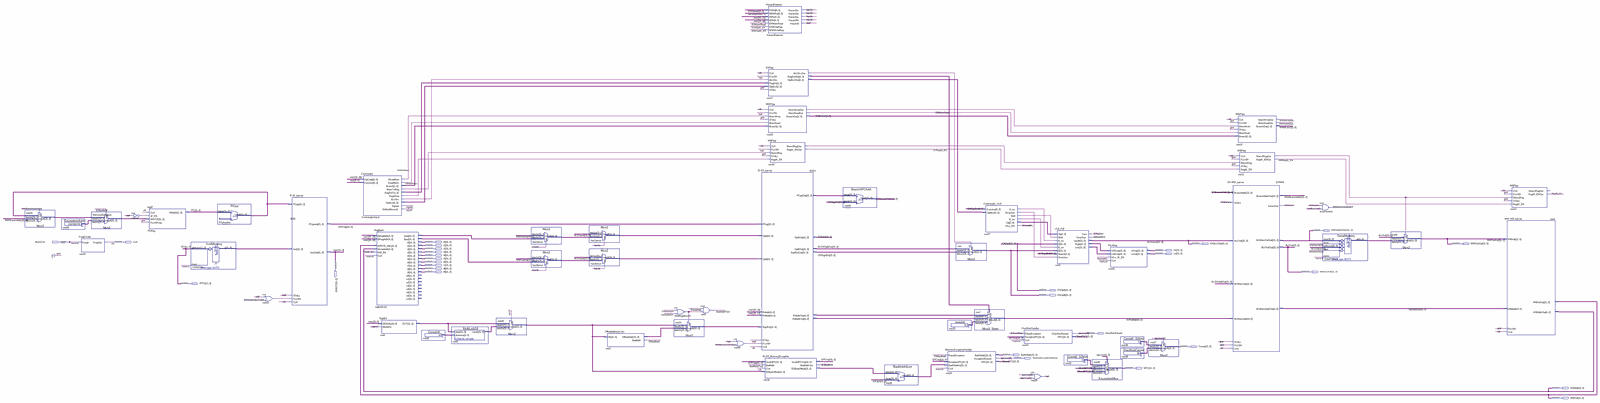
[diagram p0: schematic sheet, whole]
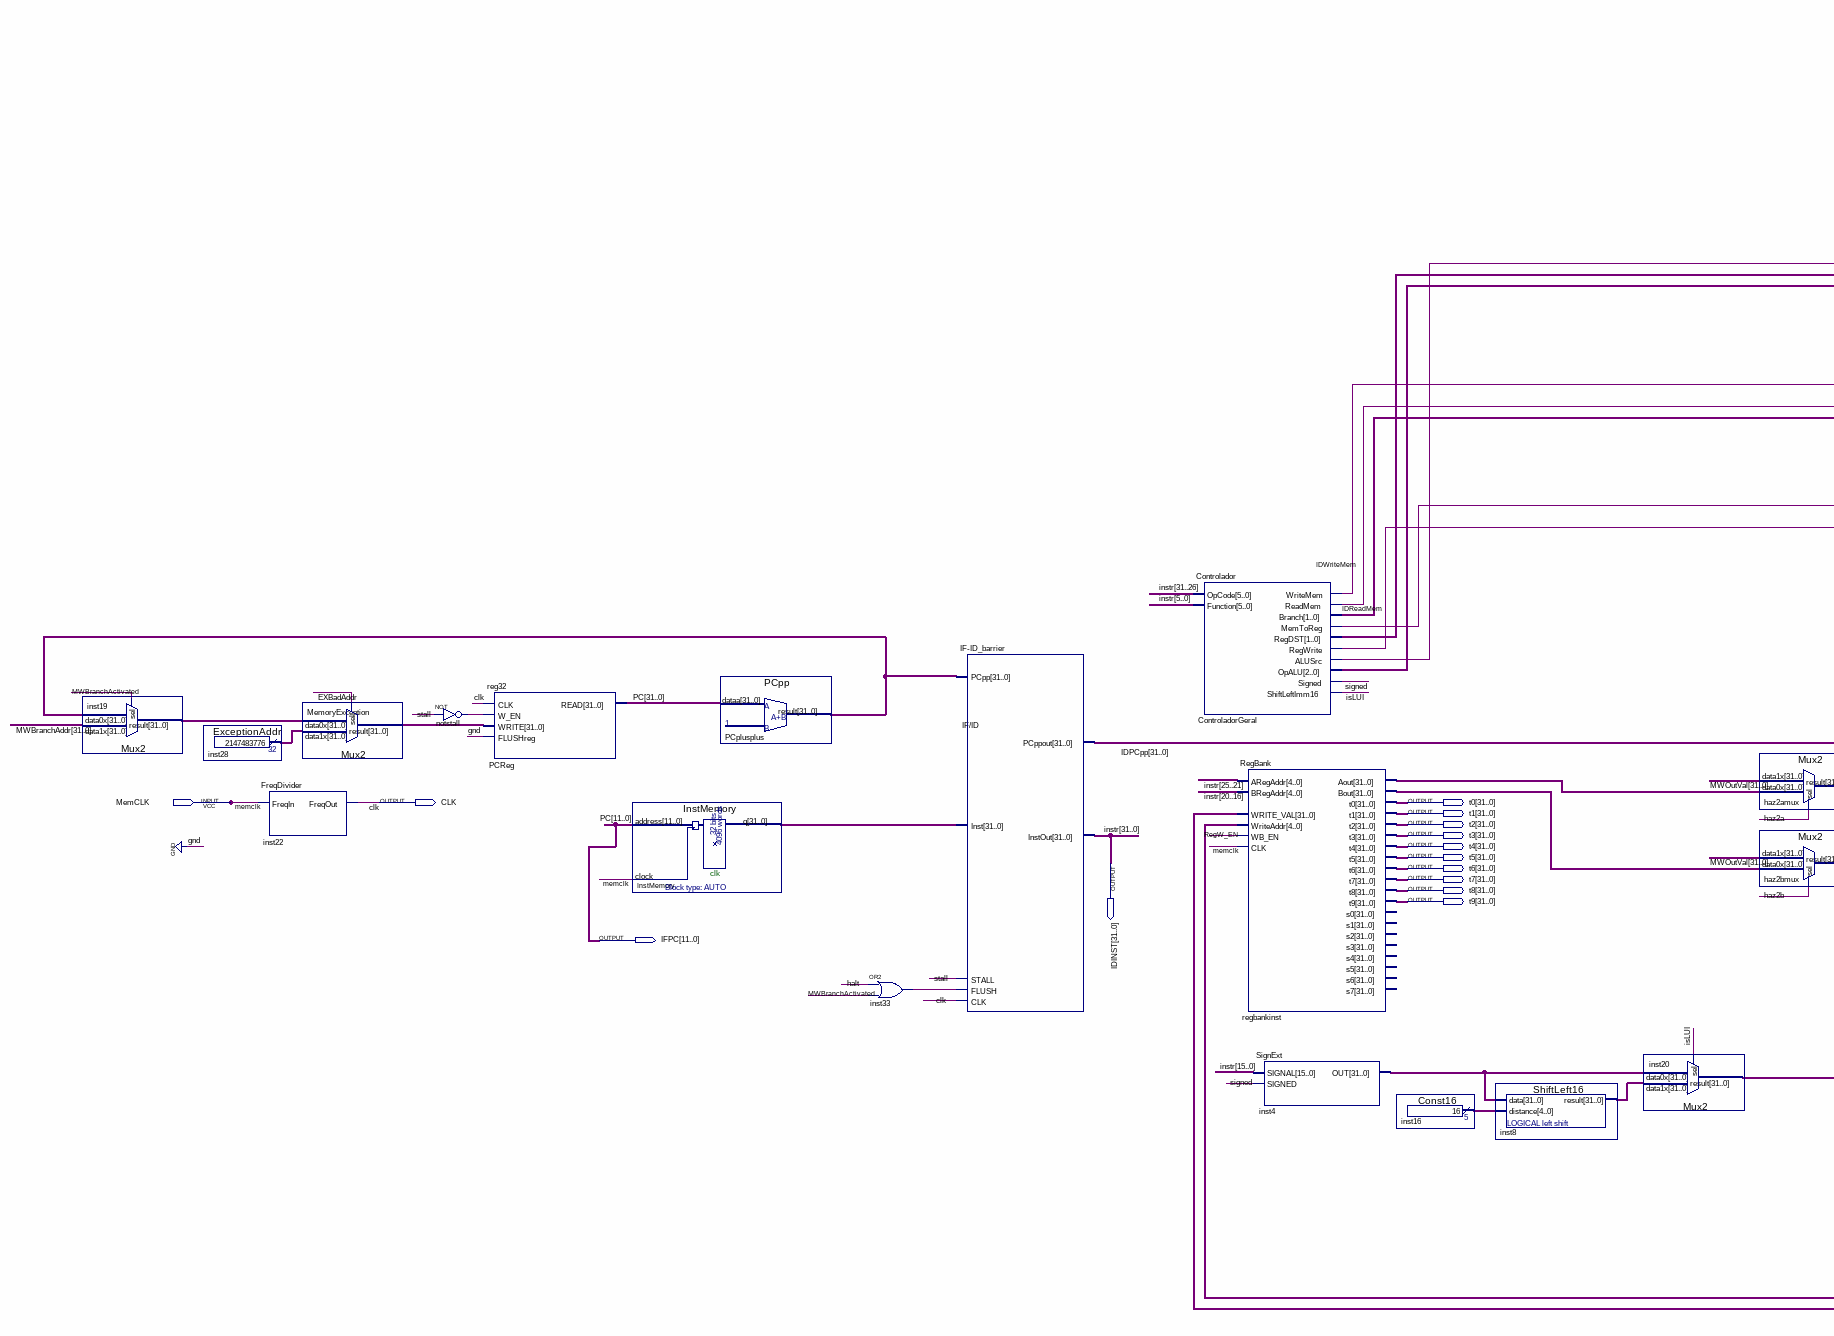
[diagram p1: schematic sheet, left part]
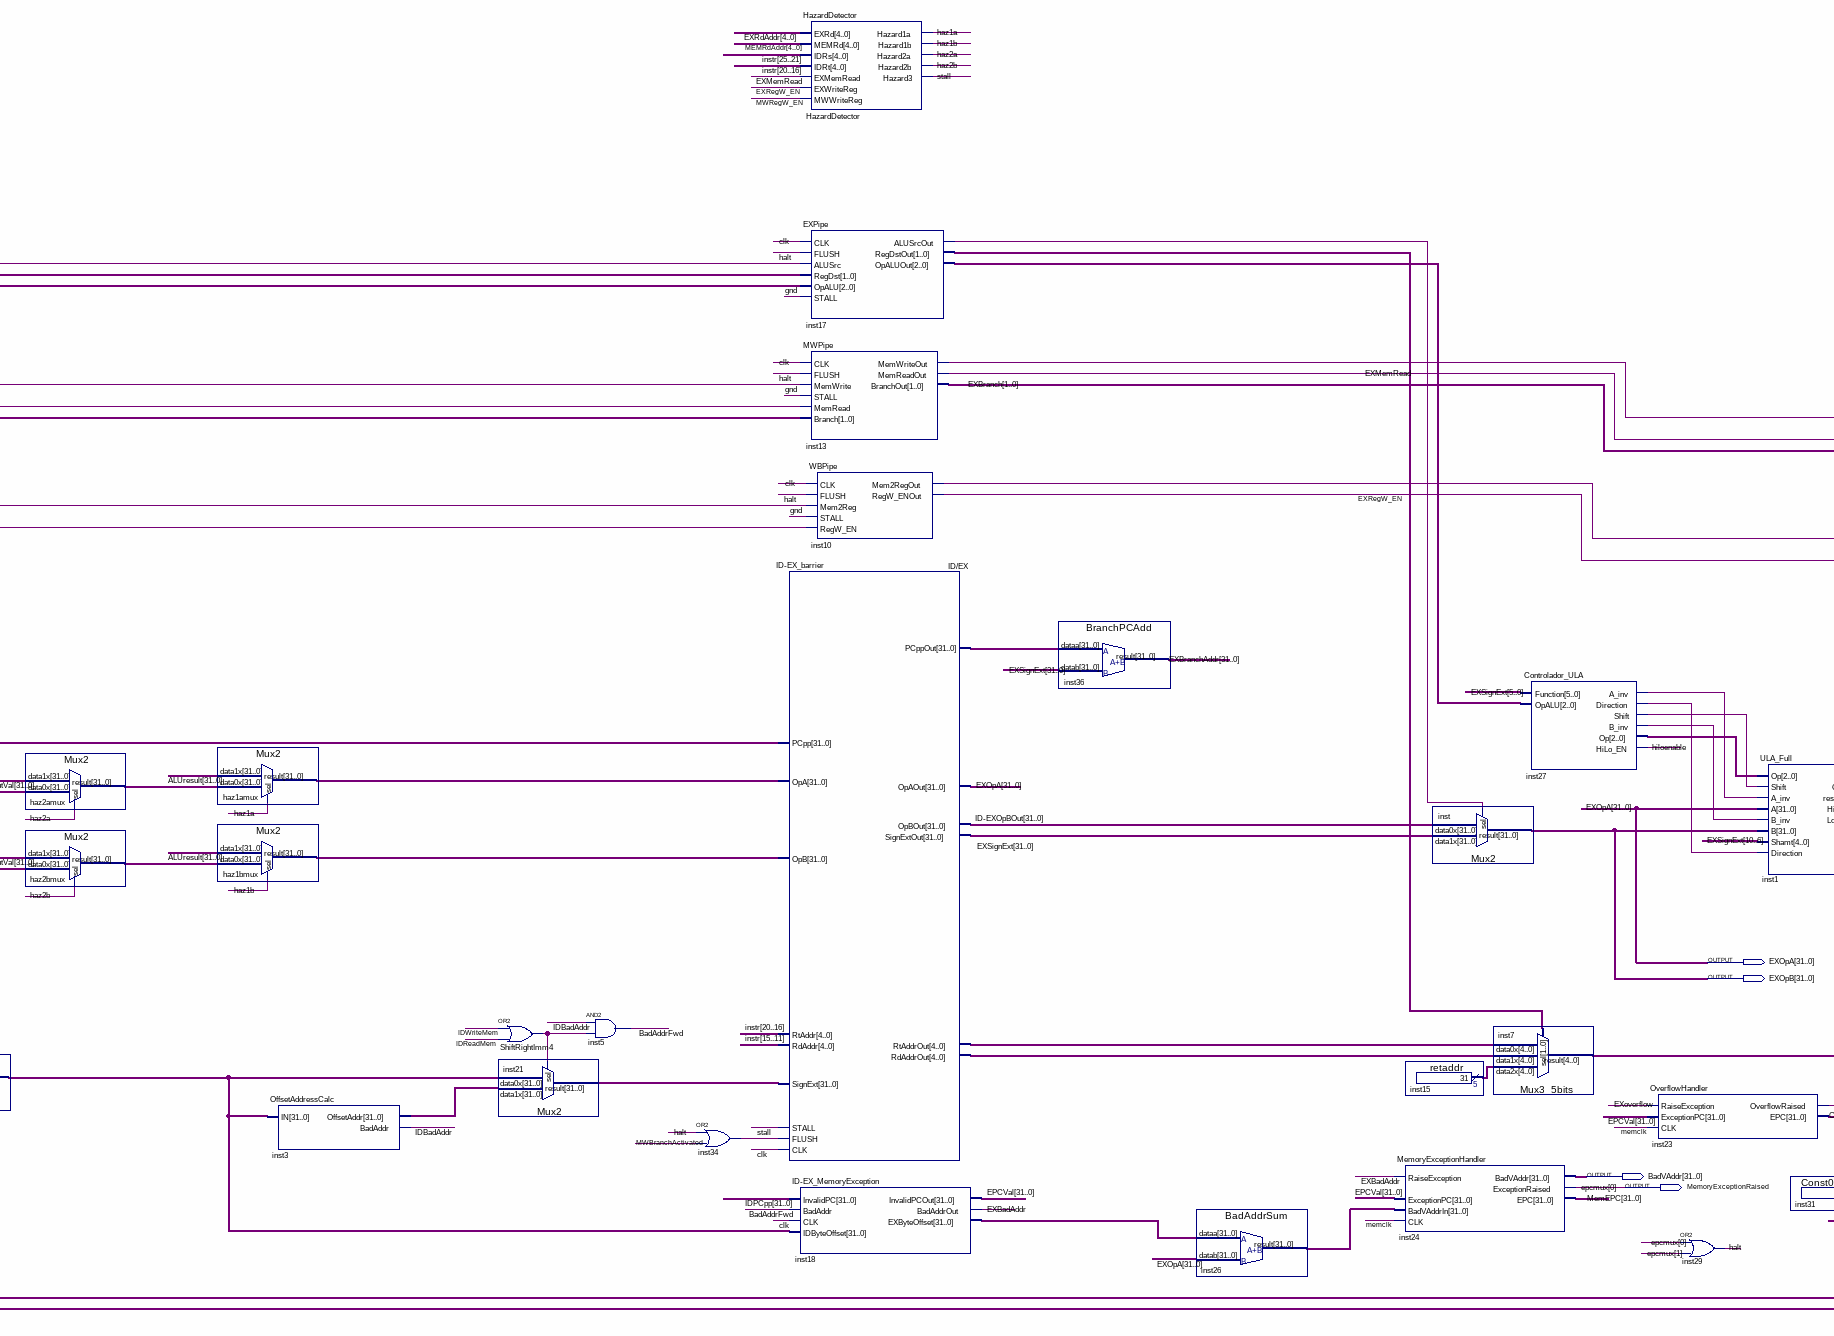
[diagram p2: schematic sheet, centre part]
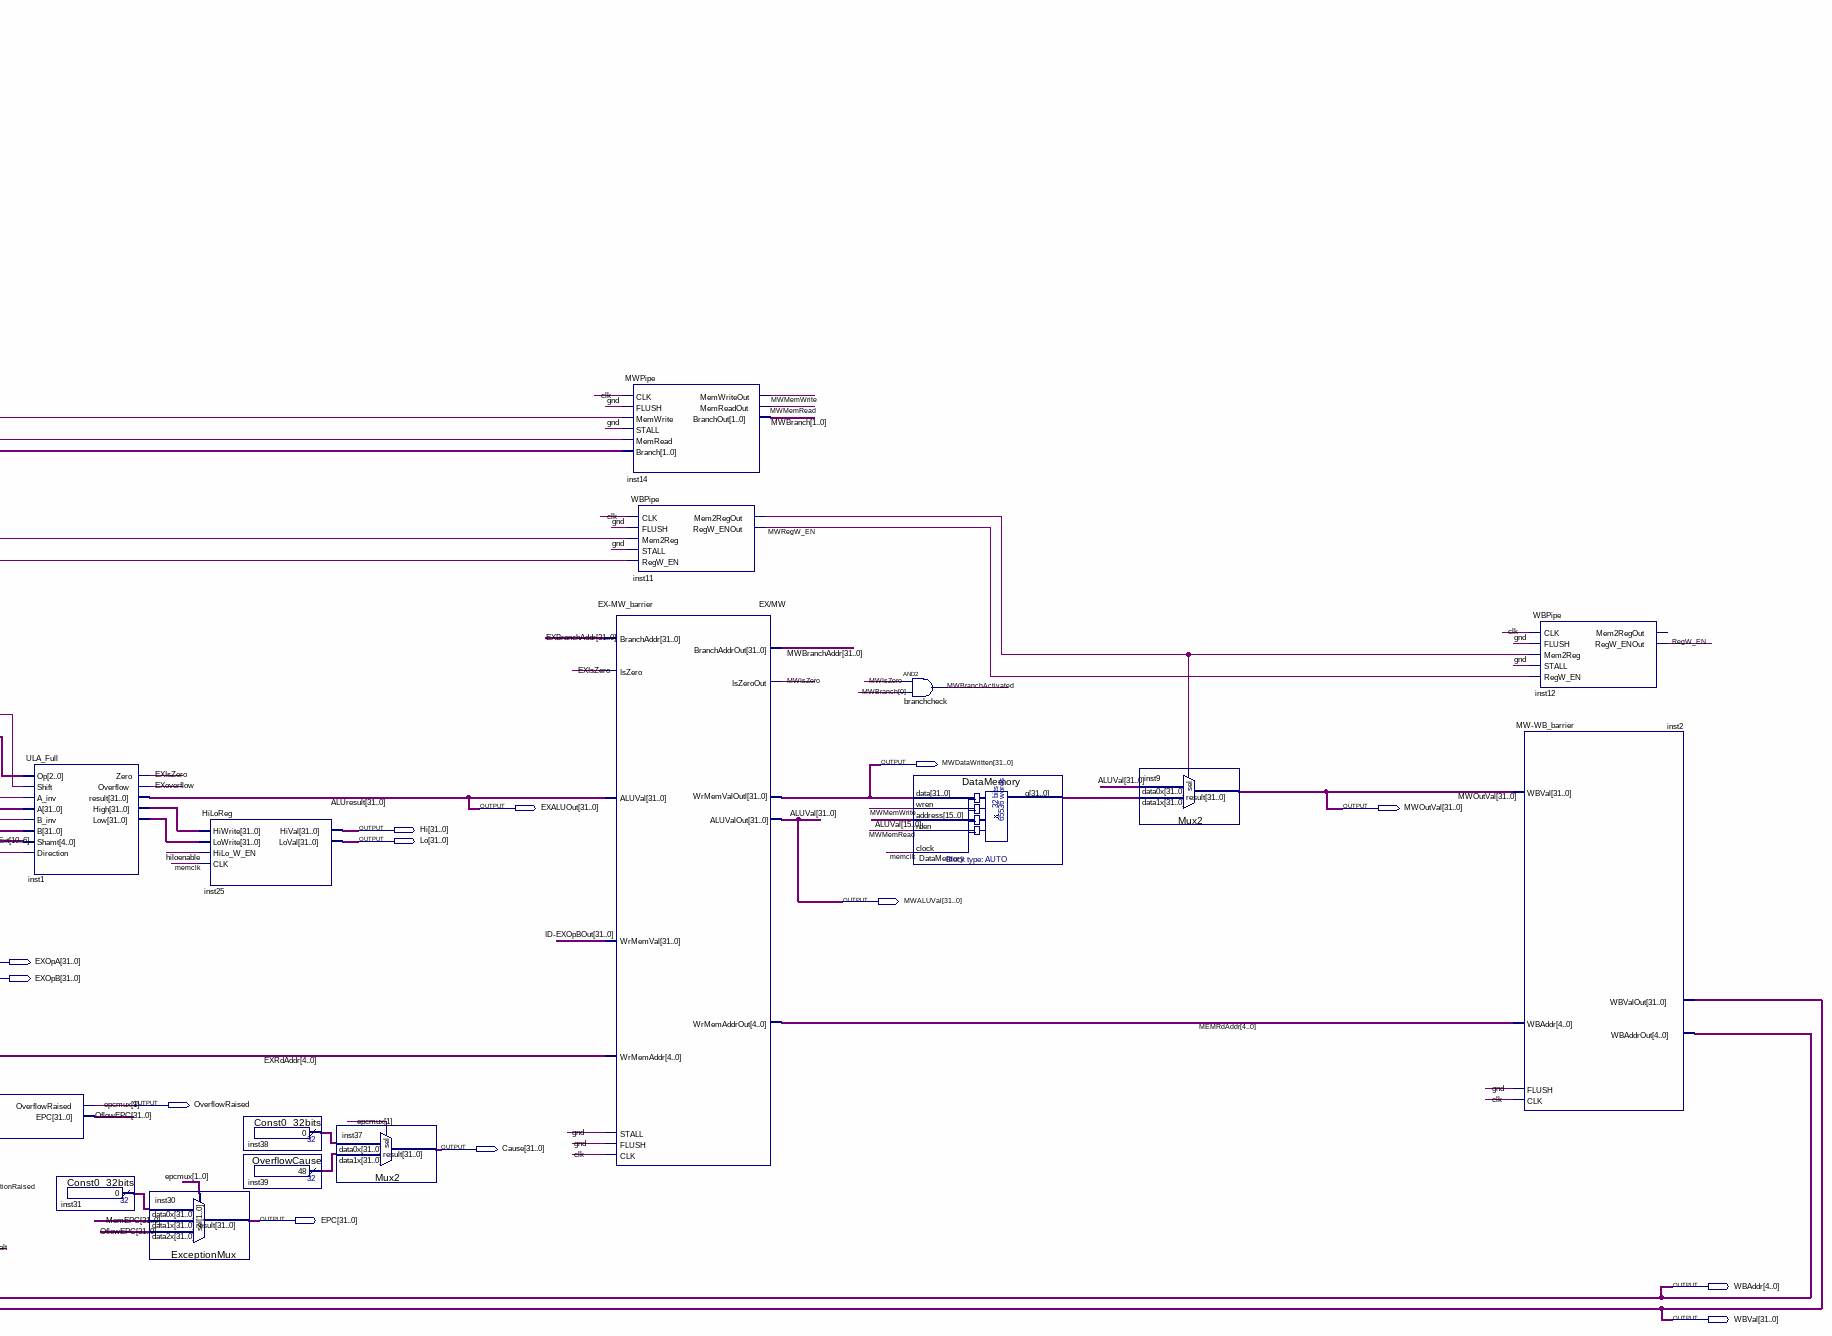
[diagram p3: schematic sheet, right part]
// Quartus schematic MIPSpipeline.bdf as structural Verilog: 55 symbols, 29 pins
module MIPSpipeline (
  input  MemCLK,
  output [31:0] MWDataWritten,
  output CLK,
  output [31:0] t0,
  output [31:0] EXALUOut,
  output [31:0] MWOutVal,
  output [31:0] t1,
  output [31:0] t2,
  output [31:0] Hi,
  output [31:0] t3,
  output [31:0] Lo,
  output [31:0] t4,
  output [31:0] t5,
  output [31:0] IDINST,
  output [31:0] t6,
  output [31:0] t7,
  output [31:0] t8,
  output [31:0] t9,
  output [31:0] MWALUVal,
  output [11:0] IFPC,
  output [31:0] EXOpA,
  output [31:0] EXOpB,
  output OverflowRaised,
  output [31:0] Cause,
  output [31:0] BadVAddr,
  output MemoryExceptionRaised,
  output [31:0] EPC,
  output [4:0] WBAddr,
  output [31:0] WBVal
);

  wire BadAddrFwd, ControladorGeral_alusrc, ControladorGeral_memtoreg, ControladorGeral_regwrite, EXBadAddr,
       EXIsZero, EXMemRead, EXoverflow, EXRegW_EN, halt, haz1a, haz1b, haz2a, haz2b, hiloenable, IDBadAddr,
       IDReadMem, IDWriteMem, inst10_mem2regout, inst11_mem2regout, inst13_memwriteout, inst17_alusrcout,
       inst27_a_inv, inst27_b_inv, inst27_direction, inst27_shift, inst33_out, inst34_out, isLUI,
       MWBranchActivated, MWIsZero, MWMemRead, MWMemWrite, MWRegW_EN, notstall_out, RegW_EN,
       ShiftRightImm4_out, \signed , stall;
  wire [1:0] ControladorGeral_branch, ControladorGeral_regdst, EXBranch, inst17_regdstout, MWBranch;
  wire [2:0] ControladorGeral_opalu, inst17_opaluout, inst27_op;
  wire [4:0] EXRdAddr, ID_EX_rdaddrout, ID_EX_rtaddrout, inst15_result, inst16_result, MEMRdAddr;
  wire [31:0] DataMemory_q, EPCVal, EXBranchAddr, EXSignExt, haz1amux_result, haz1bmux_result,
       haz2amux_result, haz2bmux_result, \ID-EXOpBOut , ID_EX_pcppout, IDPCpp, inst1_high, inst1_low,
       inst3_offsetaddr, inst4_out, inst8_result, inst18_exbyteoffset, inst19_result, inst20_result,
       inst21_result, inst26_result, inst28_result, inst31_result, inst38_result, inst39_result,
       InstMemory_q, MemEPC, MemoryException_result, MWBranchAddr, OflowEPC, PCplusplus_result,
       regbankinst_aout, regbankinst_bout;
  wire [31:12] PC;

  Mux2 inst19 (.data1x(MWBranchAddr), .data0x(PCplusplus_result), .sel(MWBranchActivated), .result(inst19_result));
  ExceptionAddr inst28 (.result(inst28_result));
  FreqDivider inst22 (.FreqIn(MemCLK), .FreqOut(CLK));
  Mux2 MemoryException (
    .data1x(inst28_result), .data0x(inst19_result), .sel(EXBadAddr), .result(MemoryException_result));
  not notstall (notstall_out, stall);
  reg32 PCReg (.CLK(CLK), .W_EN(notstall_out), .WRITE(MemoryException_result), .FLUSHreg(1'b0), .READ({PC, IFPC}));
  InstMemory InstMemory (.address(IFPC), .clock(MemCLK), .q(InstMemory_q));
  PCpp PCplusplus (.dataa({PC, IFPC}), .result(PCplusplus_result));
  or inst33 (inst33_out, halt, MWBranchActivated);
  \IF-ID_barrier  \IF/ID  (
    .PCpp(PCplusplus_result), .Inst(InstMemory_q), .STALL(stall), .FLUSH(inst33_out), .CLK(CLK),
    .PCppout(IDPCpp), .InstOut(IDINST));
  Controlador ControladorGeral (
    .OpCode(IDINST[31:26]), .Function(IDINST[5:0]), .WriteMem(IDWriteMem), .ReadMem(IDReadMem),
    .Branch(ControladorGeral_branch), .MemToReg(ControladorGeral_memtoreg), .RegDST(ControladorGeral_regdst),
    .RegWrite(ControladorGeral_regwrite), .ALUSrc(ControladorGeral_alusrc), .OpALU(ControladorGeral_opalu),
    .Signed(\signed ), .ShiftLeftImm16(isLUI));
  RegBank regbankinst (
    .ARegAddr(IDINST[25:21]), .BRegAddr(IDINST[20:16]), .WriteAddr(WBAddr), .WB_EN(RegW_EN),
    .WRITE_VAL(WBVal), .CLK(MemCLK), .Aout(regbankinst_aout), .Bout(regbankinst_bout), .t0(t0), .t1(t1),
    .t2(t2), .t3(t3), .t4(t4), .t5(t5), .t6(t6), .t7(t7), .t8(t8), .t9(t9));  // open: s0, s1, s2, s3, s4, s5, s6, s7
  SignExt inst4 (.SIGNAL(IDINST[15:0]), .SIGNED(\signed ), .OUT(inst4_out));
  Const16 inst16 (.result(inst16_result));
  ShiftLeft16 inst8 (.data(inst4_out), .distance(inst16_result), .result(inst8_result));
  Mux2 inst20 (.data1x(inst8_result), .data0x(inst4_out), .sel(isLUI), .result(inst20_result));
  Mux2 haz2amux (.data1x(MWOutVal), .data0x(regbankinst_aout), .sel(haz2a), .result(haz2amux_result));
  Mux2 haz2bmux (.data1x(MWOutVal), .data0x(regbankinst_bout), .sel(haz2b), .result(haz2bmux_result));
  Mux2 haz1amux (.data1x(EXALUOut), .data0x(haz2amux_result), .sel(haz1a), .result(haz1amux_result));
  Mux2 haz1bmux (.data1x(EXALUOut), .data0x(haz2bmux_result), .sel(haz1b), .result(haz1bmux_result));
  OffsetAddressCalc inst3 (.IN(inst20_result), .OffsetAddr(inst3_offsetaddr), .BadAddr(IDBadAddr));
  or ShiftRightImm4 (ShiftRightImm4_out, IDWriteMem, IDReadMem);
  Mux2 inst21 (.data1x(inst3_offsetaddr), .data0x(inst20_result), .sel(ShiftRightImm4_out), .result(inst21_result));
  and inst5 (BadAddrFwd, IDBadAddr, ShiftRightImm4_out);
  or inst34 (inst34_out, halt, MWBranchActivated);
  \ID-EX_barrier  \ID/EX  (
    .CLK(CLK), .OpA(haz1amux_result), .FLUSH(inst34_out), .STALL(stall), .OpB(haz1bmux_result),
    .SignExt(inst21_result), .RtAddr(IDINST[20:16]), .RdAddr(IDINST[15:11]), .PCpp(IDPCpp), .OpAOut(EXOpA),
    .OpBOut(\ID-EXOpBOut ), .SignExtOut(EXSignExt), .RtAddrOut(ID_EX_rtaddrout), .RdAddrOut(ID_EX_rdaddrout),
    .PCppOut(ID_EX_pcppout));
  HazardDetector HazardDetector (
    .EXRd(EXRdAddr), .MEMRd(MEMRdAddr), .IDRs(IDINST[25:21]), .IDRt(IDINST[20:16]), .EXMemRead(EXMemRead),
    .EXWriteReg(EXRegW_EN), .MWWriteReg(MWRegW_EN), .Hazard1a(haz1a), .Hazard1b(haz1b), .Hazard2a(haz2a),
    .Hazard2b(haz2b), .Hazard3(stall));
  EXPipe inst17 (
    .CLK(CLK), .FLUSH(halt), .ALUSrc(ControladorGeral_alusrc), .RegDst(ControladorGeral_regdst),
    .OpALU(ControladorGeral_opalu), .STALL(1'b0), .ALUSrcOut(inst17_alusrcout), .RegDstOut(inst17_regdstout),
    .OpALUOut(inst17_opaluout));
  MWPipe inst13 (
    .CLK(CLK), .FLUSH(halt), .MemWrite(IDWriteMem), .STALL(1'b0), .MemRead(IDReadMem),
    .Branch(ControladorGeral_branch), .MemWriteOut(inst13_memwriteout), .MemReadOut(EXMemRead),
    .BranchOut(EXBranch));
  WBPipe inst10 (
    .CLK(CLK), .FLUSH(halt), .Mem2Reg(ControladorGeral_memtoreg), .STALL(1'b0),
    .RegW_EN(ControladorGeral_regwrite), .Mem2RegOut(inst10_mem2regout), .RegW_ENOut(EXRegW_EN));
  \ID-EX_MemoryException  inst18 (
    .InvalidPC(IDPCpp), .BadAddr(BadAddrFwd), .CLK(CLK), .IDByteOffset(inst20_result), .InvalidPCOut(EPCVal),
    .BadAddrOut(EXBadAddr), .EXByteOffset(inst18_exbyteoffset));
  BranchPCAdd inst36 (.dataa(ID_EX_pcppout), .datab(EXSignExt), .result(EXBranchAddr));
  BadAddrSum inst26 (.dataa(inst18_exbyteoffset), .datab(EXOpA), .result(inst26_result));
  MemoryExceptionHandler inst24 (
    .RaiseException(EXBadAddr), .BadVAddrIn(inst26_result), .ExceptionPC(EPCVal), .CLK(MemCLK),
    .BadVAddr(BadVAddr), .ExceptionRaised(MemoryExceptionRaised), .EPC(MemEPC));
  Mux2 inst (.data1x(EXSignExt), .data0x(\ID-EXOpBOut ), .sel(inst17_alusrcout), .result(EXOpB));
  retaddr inst15 (.result(inst15_result));
  Controlador_ULA inst27 (
    .Function(EXSignExt[5:0]), .OpALU(inst17_opaluout), .A_inv(inst27_a_inv), .Direction(inst27_direction),
    .Shift(inst27_shift), .B_inv(inst27_b_inv), .Op(inst27_op), .HiLo_EN(hiloenable));
  Mux3_5bits inst7 (
    .data2x(inst15_result), .data1x(ID_EX_rdaddrout), .data0x(ID_EX_rtaddrout), .sel(inst17_regdstout),
    .result(EXRdAddr));
  OverflowHandler inst23 (
    .RaiseException(EXoverflow), .ExceptionPC(EPCVal), .CLK(MemCLK), .OverflowRaised(OverflowRaised),
    .EPC(OflowEPC));
  or inst29 (halt, MemoryExceptionRaised, OverflowRaised);
  ULA_Full inst1 (
    .Op(inst27_op), .Shift(inst27_shift), .A_inv(inst27_a_inv), .A(EXOpA), .B_inv(inst27_b_inv), .B(EXOpB),
    .Shamt(EXSignExt[10:6]), .Direction(inst27_direction), .Zero(EXIsZero), .Overflow(EXoverflow),
    .result(EXALUOut), .High(inst1_high), .Low(inst1_low));
  Const0_32bits inst31 (.result(inst31_result));
  ExceptionMux inst30 (
    .data2x(OflowEPC), .data1x(MemEPC), .data0x(inst31_result),
    .sel({OverflowRaised, MemoryExceptionRaised}), .result(EPC));
  HiLoReg inst25 (
    .HiWrite(inst1_high), .LoWrite(inst1_low), .HiLo_W_EN(hiloenable), .CLK(MemCLK), .HiVal(Hi), .LoVal(Lo));
  Const0_32bits inst38 (.result(inst38_result));
  OverflowCause inst39 (.result(inst39_result));
  Mux2 inst37 (.data1x(inst39_result), .data0x(inst38_result), .sel(OverflowRaised), .result(Cause));
  MWPipe inst14 (
    .CLK(CLK), .FLUSH(1'b0), .MemWrite(inst13_memwriteout), .STALL(1'b0), .MemRead(EXMemRead),
    .Branch(EXBranch), .MemWriteOut(MWMemWrite), .MemReadOut(MWMemRead), .BranchOut(MWBranch));
  WBPipe inst11 (
    .CLK(CLK), .FLUSH(1'b0), .Mem2Reg(inst10_mem2regout), .STALL(1'b0), .RegW_EN(EXRegW_EN),
    .Mem2RegOut(inst11_mem2regout), .RegW_ENOut(MWRegW_EN));
  \EX-MW_barrier  \EX/MW  (
    .IsZero(EXIsZero), .STALL(1'b0), .FLUSH(1'b0), .CLK(CLK), .BranchAddr(EXBranchAddr),
    .WrMemVal(\ID-EXOpBOut ), .WrMemAddr(EXRdAddr), .ALUVal(EXALUOut), .IsZeroOut(MWIsZero),
    .WrMemValOutl(MWDataWritten), .WrMemAddrOut(MEMRdAddr), .ALUValOut(MWALUVal), .BranchAddrOut(MWBranchAddr));
  and branchcheck (MWBranchActivated, MWIsZero, MWBranch[0]);
  DataMemory DataMemory (
    .data(MWDataWritten), .wren(MWMemWrite), .address(MWALUVal[15:0]), .rden(MWMemRead), .clock(MemCLK),
    .q(DataMemory_q));
  Mux2 inst9 (.data1x(DataMemory_q), .data0x(MWALUVal), .sel(inst11_mem2regout), .result(MWOutVal));
  \MW-WB_barrier  inst2 (
    .CLK(CLK), .FLUSH(1'b0), .WBAddr(MEMRdAddr), .WBVal(MWOutVal), .WBAddrOut(WBAddr), .WBValOut(WBVal));
  WBPipe inst12 (
    .CLK(CLK), .FLUSH(1'b0), .Mem2Reg(inst11_mem2regout), .STALL(1'b0), .RegW_EN(MWRegW_EN),
    .RegW_ENOut(RegW_EN));  // open: Mem2RegOut

  // Other names for the same wires on the sheet: ALUresult[31:0] = EXALUOut;
  //   epcmux[1:0] = {OverflowRaised, MemoryExceptionRaised}; instr[31:0] = IDINST; PC[11:0] = IFPC;
  //   ALUVal[31:0] = MWALUVal

  // Notes on the sheet:
  //   clk
endmodule
